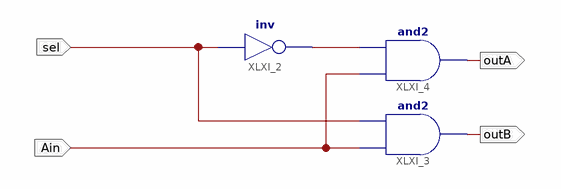
[diagram p0: schematic sheet 1]
// Xilinx ISE schematic oneBitDemux.sch (spartan3e) as structural Verilog: 3 symbols, 4 ports
module oneBitDemux (
  input  Ain,
  input  sel,
  output outA,
  output outB
);

  wire XLXN_1;

  not XLXI_2 (XLXN_1, sel);
  and XLXI_3 (outB, Ain, sel);
  and XLXI_4 (outA, Ain, XLXN_1);
endmodule
